# Altium schematic sheet Sheet3.SchDoc
size 420 x 297 mm; Scale: 1:1; Обозначение документа: НГТУ.436229.007 Э3; Номер листа: 3
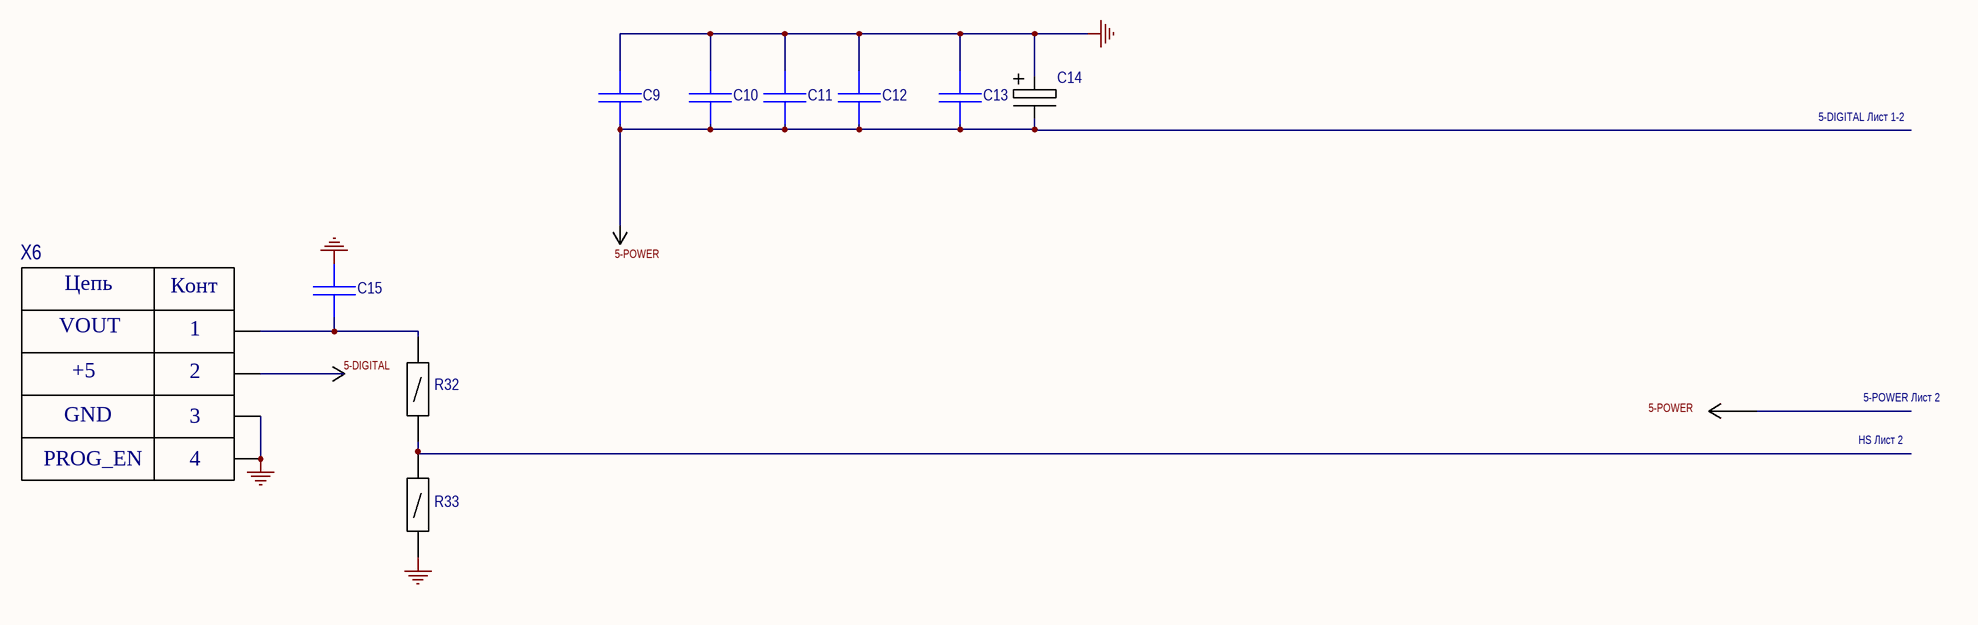
[diagram p0: Sheet3.SchDoc]

## Parts
C9  CAP  [CAP SMD 1812]  (value not drawn)
C10  CAP  [CAP SMD 1206]  (value not drawn)
C11  CAP  [CAP SMD 1206]  (value not drawn)
C12  CAP  [CAP SMD 1206]  (value not drawn)
C13  CAP  [CAP SMD 1206]  (value not drawn)
C14  (no value)  [Radial 5x11mm]
C15  CAP  [CAP SMD 1206]  (value not drawn)
R32  resistor  [RESISTOR SMD 0805]  (value not drawn)
R33  resistor  [RESISTOR SMD 0805]  (value not drawn)
X6  PLS3_1  [PLS4]  (value not drawn)

## Nets
GND: C9.2 C10.2 C11.2 C12.2 C13.2 C14.2 C15.2 R33.1 X6.3 X6.4
5-DIGITAL: X6.2
NetC9_1: C9.1 C10.1 C11.1 C12.1 C13.1 C14.1
NetC15_1: C15.1 R32.2 X6.1
NetR32_1: R32.1 R33.2

## Notes on the sheet
- 5-DIGITAL Лист 1-2
- HS Лист 2
- 5-POWER Лист 2
- Labels drawn without touching a wire or pin: 5-POWER
- Подп. и дата
- Инв. № дубл.
- Взам. инв. №
- Инв. № подл.
- Изм.
- Лист
- № докум.
- Подп.
- Дата
- Копировал
- Формат А3
- (in symbol PLS3_1) Цепь; Конт; VOUT; +5; GND; PROG_EN

## Library data of the parts
C14 = CapPol_1